# Altium project Project_Ontwerpen.PrjPcb
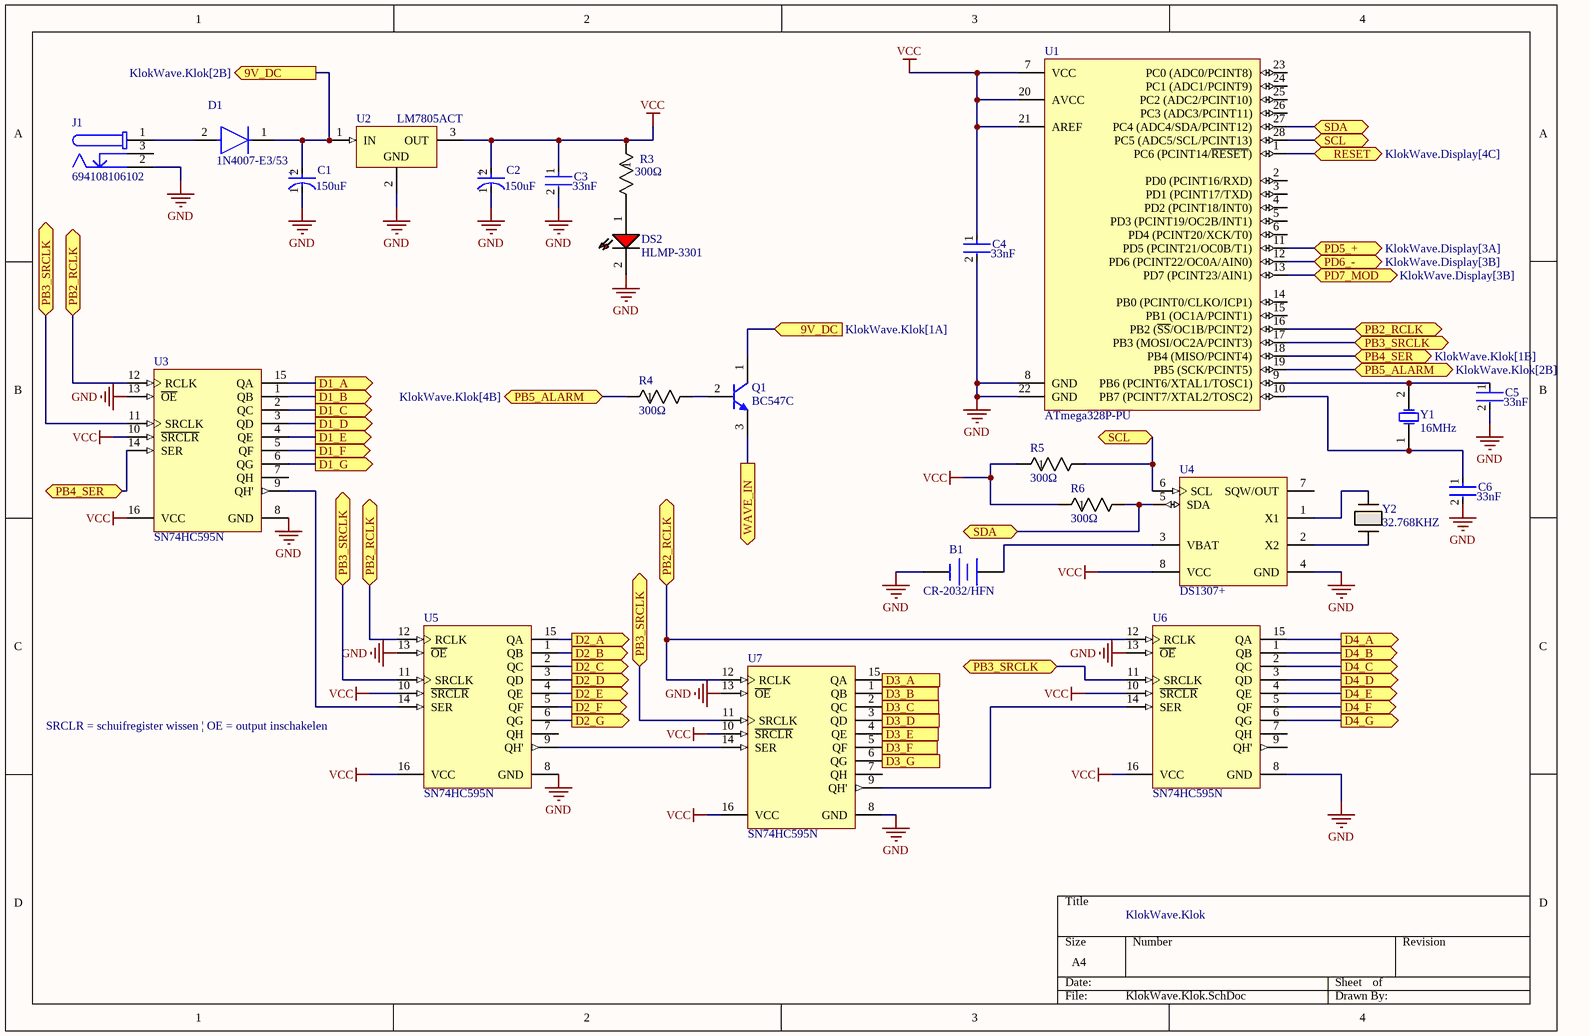
[diagram p0: KlokWave.Klok.SchDoc]
3 sheets, 111 parts. Net scope: flat (ports and power ports of the same name join across sheets).
Board file: KlokWave.PcbDoc
Sheets:
  KlokWave.Klok.SchDoc
  KlokWave.Wave.SchDoc
  KlokWave.Display.SchDoc

## Sheet KlokWave.Klok.SchDoc
size A4; SheetNumber: 1; SheetTotal: 3

### Parts
B1  CR-2032/HFN  [THT 3VBAT: PANA-CR-2032HFN]
C1  Capacitance: 150uF  [THT PolCondensator FP-OS-CON-TH-E7-d_0_45-MFG]  (hidden comment: 16SEPC150MD)
C2  Capacitance: 150uF  [THT PolCondensator FP-OS-CON-TH-E7-d_0_45-MFG]  (hidden comment: 16SEPC150MD)
C3  Capacitance: 33nF  [THT NonPol CerCOndensator: FP-565R30GASS33-MFG]  (hidden comment: 565R30GASS33)
C4  Capacitance: 33nF  [THT NonPol CerCOndensator: FP-565R30GASS33-MFG]  (hidden comment: 565R30GASS33)
C5  Capacitance: 33nF  [THT NonPol CerCOndensator: FP-565R30GASS33-MFG]  (hidden comment: 565R30GASS33)
C6  Capacitance: 33nF  [THT NonPol CerCOndensator: FP-565R30GASS33-MFG]  (hidden comment: 565R30GASS33)
D1  1N4007-E3/53  [THT Diode FP-1N4007-E3-53-MFG]
DS2  HLMP-3301  [THT LED: AVAG-HLMP-3301-2]
J1  694108106102  [THT DC Power Jack: 694106301002]
Q1  BC547C  [THT NPN Transistor: ONSC-TO-92-3-29-11_AM_BL]
R3  Resistance: 300Ω  [THT Resistor: RES_AC03_VIS]  (hidden comment: AC03000003000JAC00)
R4  Resistance: 300Ω  [THT Resistor: RES_AC03_VIS]  (hidden comment: AC03000003000JAC00)
R5  Resistance: 300Ω  [THT Resistor: RES_AC03_VIS]  (hidden comment: AC03000003000JAC00)
R6  Resistance: 300Ω  [THT Resistor: RES_AC03_VIS]  (hidden comment: AC03000003000JAC00)
U1  ATmega328P-PU  [THT ATMEGA328P-PU: 28P3]
U2  LM7805ACT  [THT LM7805: FAIR-TO-220-3]
U3  SN74HC595N  [THT 74HC595N: N0016A]
U4  DS1307+  [THT Chip DS1307: P8+2]
U5  SN74HC595N  [THT 74HC595N: N0016A]
U6  SN74HC595N  [THT 74HC595N: N0016A]
U7  SN74HC595N  [THT 74HC595N: N0016A]
Y1  16MHz  [THT 16 MHz: WE-XTAL_HC49/4H]
Y2  32.768KHZ  [THT 32 KHz OSC: XTAL_AB38T_ABR]

### Ports
9V_DC (in, see KlokWave.Klok[1A]), 9V_DC (out, see KlokWave.Klok[2B]), D1_A (out, see KlokWave.Display[2A]), D1_B (out, see KlokWave.Display[2A]), D1_C (out, see KlokWave.Display[2A]), D1_D (out, see KlokWave.Display[2A]), D1_E (out, see KlokWave.Display[2A]), D1_F (out, see KlokWave.Display[2A]), D1_G (out, see KlokWave.Display[2A]), D2_A (out, see KlokWave.Display[2B]), D2_B (out, see KlokWave.Display[2B]), D2_C (out, see KlokWave.Display[2B]), D2_D (out, see KlokWave.Display[2B]), D2_E (out, see KlokWave.Display[2B]), D2_F (out, see KlokWave.Display[2B]), D2_G (out, see KlokWave.Display[2B]), D3_A (out, see KlokWave.Display[2C]), D3_B (out, see KlokWave.Display[2C]), D3_C (out, see KlokWave.Display[2C]), D3_D (out, see KlokWave.Display[2C]), D3_E (out, see KlokWave.Display[2C]), D3_F (out, see KlokWave.Display[2C]), D3_G (out, see KlokWave.Display[2C]), D4_A (out, see KlokWave.Display[2C]), D4_B (out, see KlokWave.Display[2C]), D4_C (out, see KlokWave.Display[2C]), D4_D (out, see KlokWave.Display[2D]), D4_E (out, see KlokWave.Display[2D]), D4_F (out, see KlokWave.Display[2D]), D4_G (out, see KlokWave.Display[2D]), PB2_RCLK (bidir, see KlokWave.Klok[1B], KlokWave.Klok[1C], KlokWave.Klok[2C]), PB2_RCLK (bidir, see KlokWave.Klok[1B], KlokWave.Klok[1C], KlokWave.Klok[4B]), PB2_RCLK (bidir, see KlokWave.Klok[1B], KlokWave.Klok[2C], KlokWave.Klok[4B]), PB2_RCLK (bidir, see KlokWave.Klok[1C], KlokWave.Klok[2C], KlokWave.Klok[4B]), PB3_SRCLK (bidir, see KlokWave.Klok[1B], KlokWave.Klok[1C], KlokWave.Klok[2C], KlokWave.Klok[3C]), PB3_SRCLK (bidir, see KlokWave.Klok[1B], KlokWave.Klok[1C], KlokWave.Klok[2C], KlokWave.Klok[4B]), PB3_SRCLK (bidir, see KlokWave.Klok[1B], KlokWave.Klok[1C], KlokWave.Klok[3C], KlokWave.Klok[4B]), PB3_SRCLK (bidir, see KlokWave.Klok[1B], KlokWave.Klok[2C], KlokWave.Klok[3C], KlokWave.Klok[4B]), PB3_SRCLK (bidir, see KlokWave.Klok[1C], KlokWave.Klok[2C], KlokWave.Klok[3C], KlokWave.Klok[4B]), PB4_SER (bidir, see KlokWave.Klok[1B]), PB4_SER (bidir, see KlokWave.Klok[4B]), PB5_ALARM (bidir, see KlokWave.Klok[2B]), PB5_ALARM (bidir, see KlokWave.Klok[4B]), PD5_+ (bidir, see KlokWave.Display[3A]), PD6_- (bidir, see KlokWave.Display[3B]), PD7_MOD (bidir, see KlokWave.Display[3B]), RESET (bidir, see KlokWave.Display[4C]), SCL (bidir, see KlokWave.Klok[3B]), SCL (bidir, see KlokWave.Klok[4A]), SDA (bidir, see KlokWave.Klok[3C]), SDA (bidir, see KlokWave.Klok[4A]), WAVE_IN (out, see KlokWave.Wave[4A])

### Nets
GND: B1.2(-) C1.1(C) C2.1(C) C3.2 C4.2 C5.2 C6.2 DS2.2(A) J1.2 U1.8(GND) U1.22(GND) U2.2(GND) U3.8(GND) U3.13(~{OE}) U4.4(GND) U5.8(GND) U5.13(~{OE}) U6.8(GND) U6.13(~{OE}) U7.8(GND) U7.13(~{OE})
VCC: C2.2(A) C3.1 C4.1 R3.1 R5.1 R6.1 U1.7(VCC) U1.20(AVCC) U1.21(AREF) U2.3(OUT) U3.10(~{SRCLR}) U3.16(VCC) U4.8(VCC) U5.10(~{SRCLR}) U5.16(VCC) U6.10(~{SRCLR}) U6.16(VCC) U7.10(~{SRCLR}) U7.16(VCC)
NetB1_1: B1.1(+) U4.3(VBAT)
NetC1_2: C1.2(A) D1.1(C) Q1.1(C) U2.1(IN) ; port 9V_DC
NetC5_1: C5.1 U1.9(PB6_(PCINT6/XTAL1/TOSC1)) Y1.2(OSC2)
NetC6_1: C6.1 U1.10(PB7_(PCINT7/XTAL2/TOSC2)) Y1.1(OSC1)
NetC19_2: Q1.3(E) ; port WAVE_IN
NetD1_2: D1.2(A) J1.1
NetDS2_1: DS2.1(K) R3.2
NetLED1_1: U3.4(QE) ; port D1_E
NetLED1_2: U3.3(QD) ; port D1_D
NetLED1_4: U3.2(QC) ; port D1_C
NetLED1_6: U3.1(QB) ; port D1_B
NetLED1_7: U3.15(QA) ; port D1_A
NetLED1_9: U3.5(QF) ; port D1_F
NetLED1_10: U3.6(QG) ; port D1_G
NetLED2_1: U5.4(QE) ; port D2_E
NetLED2_2: U5.3(QD) ; port D2_D
NetLED2_4: U5.2(QC) ; port D2_C
NetLED2_6: U5.1(QB) ; port D2_B
NetLED2_7: U5.15(QA) ; port D2_A
NetLED2_9: U5.5(QF) ; port D2_F
NetLED2_10: U5.6(QG) ; port D2_G
NetLED3_1: U7.4(QE) ; port D3_E
NetLED3_2: U7.3(QD) ; port D3_D
NetLED3_4: U7.2(QC) ; port D3_C
NetLED3_6: U7.1(QB) ; port D3_B
NetLED3_7: U7.15(QA) ; port D3_A
NetLED3_9: U7.5(QF) ; port D3_F
NetLED3_10: U7.6(QG) ; port D3_G
NetLED4_1: U6.4(QE) ; port D4_E
NetLED4_2: U6.3(QD) ; port D4_D
NetLED4_4: U6.2(QC) ; port D4_C
NetLED4_6: U6.1(QB) ; port D4_B
NetLED4_7: U6.15(QA) ; port D4_A
NetLED4_9: U6.5(QF) ; port D4_F
NetLED4_10: U6.6(QG) ; port D4_G
NetQ1_2: Q1.2(B) R4.2
NetR4_1: R4.1 U1.19(PB5_(SCK/PCINT5)) ; port PB5_ALARM
NetR5_2: R5.2 U1.28(PC5_(ADC5/SCL/PCINT13)) U4.6(SCL) ; port SCL
NetR6_2: R6.2 U1.27(PC4_(ADC4/SDA/PCINT12)) U4.5(SDA) ; port SDA
NetR50_1: U1.1(PC6_(PCINT14/~{RESET})) ; port RESET
NetSW1_1: U1.11(PD5_(PCINT21/OC0B/T1)) ; port PD5_+
NetSW2_1: U1.12(PD6_(PCINT22/OC0A/AIN0)) ; port PD6_-
NetSW3_1: U1.13(PD7_(PCINT23/AIN1)) ; port PD7_MOD
NetU1_16: U1.16(PB2_(~{SS}/OC1B/PCINT2)) U3.12(RCLK) U5.12(RCLK) U6.12(RCLK) U7.12(RCLK) ; port PB2_RCLK
NetU1_17: U1.17(PB3_(MOSI/OC2A/PCINT3)) U3.11(SRCLK) U5.11(SRCLK) U6.11(SRCLK) U7.11(SRCLK) ; port PB3_SRCLK
NetU1_18: U1.18(PB4_(MISO/PCINT4)) U3.14(SER) ; port PB4_SER
NetU3_9: U3.9(QH') U5.14(SER)
NetU4_1: U4.1(X1) Y2.1
NetU4_2: U4.2(X2) Y2.2
NetU5_9: U5.9(QH') U7.14(SER)
NetU6_14: U6.14(SER) U7.9(QH')

Not connected (* = marked no-connect by the designer): J1 3; U1 2(PD0_(PCINT16/RXD)) 3(PD1_(PCINT17/TXD)) 4(PD2_(PCINT18/INT0)) 5(PD3_(PCINT19/OC2B/INT1)) 6(PD4_(PCINT20/XCK/T0)) 14(PB0_(PCINT0/CLKO/ICP1)) 15(PB1_(OC1A/PCINT1)) 23(PC0_(ADC0/PCINT8)) 24(PC1_(ADC1/PCINT9)) 25(PC2_(ADC2/PCINT10)) 26(PC3_(ADC3/PCINT11)); U3 7(QH); U4 7(SQW/OUT); U5 7(QH); U6 7(QH) 9(QH'); U7 7(QH)

### Notes on the sheet
- (near U5) SRCLR = schuifregister wissen | OE = output inschakelen
- KlokWave.Klok
- (in symbol CMP-05428-000489-1) +

### Library data of the parts
B1 = CMP-2000-05296-1: Coin Cell Battery, 225 mAh, 0.2 mA, 3 V, -30 to 60 degC, Bulk; Manufacturer: Panasonic; SVHC: 1,2-dimethoxyethane,ethyleneglycoldimethylether(EGDME)(15-Jun-2015); Battery Size Code: 2032; Battery Voltage: 3V; Battery IEC Code: CR2032; Battery NEDA Code: 5004LC; External Height: 3.2mm; Battery Terminals: PCBPins; Battery Capacity: 220mAh; External Diameter: 20mm; Battery Technology: LithiumManganeseDioxide; Product Range: -; Datasheet Version: Rev. 0, 05/2010; Manufacturer URL: http://www.panasonic.com/; External Depth: -; Weight: 2.9g; Datasheet URL: https://datasheet.ciiva.com/3/aaa4000de87-3072.pdf; External Width: -
C1 C2 = CMP-05428-000489-1: Conductive Polymer Aluminum Solid Capacitors (OS-CON) 150uF ±20% 16V RADIAL TH 8x7mm; Ripple Current: 3.22A; ESR (Equivalent Series Resistance): 22mR; Polarity: Polar; Leakage Current: 500uA; Dissipation Factor: 12%; Life (Hours): 5000Hour; Lead Diameter: 0.45mm; Voltage Rating: 16V; Case/Package: Radial; Mount: Through Hole; Series: OS-CON™, SEPC; Lead Pitch: 3.5mm; Height - Seated (Max): 0.276inch; Diameter: 8mm; Max Operating Temperature: 105°C; Length: 7mm; Voltage Rating (DC): 16V; Lead Free: Lead Free; RoHS Compliant: Yes; Package Quantity: 200; Voltage: 16V; Packaging: Bulk; Tolerance: 20%; REACH SVHC: No SVHC; Termination: Radial; Number of Pins: 7; Min Operating Temperature: -55°C; Height: 7mm
C3-C6 = CMP-00030-41968055-1: 565R30GASS33 33nF 3 kV dc THT Ceramic Single Layer Capacitor; Z5U Dielectric Radial 565R Series; Voltage: 3kV; Tolerance: 20%; Lead Diameter: 640µm; Diameter: 22.9mm; Lead Free: Lead Free; Material: Ceramic; Schedule B: 8532230060; Depth: 6.1mm; Mount: Radial; Max Operating Temperature: 105°C; Composition: Ceramic; RoHS: Compliant; Min Operating Temperature: -25°C; Dielectric: Z5U; NexarPartId: 41968055; Height: 22.9mm; Voltage Rating: 3kV; Lead Pitch: 9.52mm; Termination: Radial; Packaging: Bulk; Case/Package: Radial; Voltage Rating (DC): 3kV
D1 = CMP-02540-000066-1: 1N4007 DIODE GEN PURP 1KV 1A DO204AL; Max Surge Current: 45A; Max Reverse Current: 5uA; Element Configuration: Single; Max Repetitive Reverse Voltage (Vrrm): 1kV; Max Reverse Voltage (DC): 1kV; Packaging: Tape and Reel; Peak Non-Repetitive Surge Current: 45A; Reverse Voltage: 1kV; Number of Pins: 2; Contact Plating: Tin; Mount: Through Hole; Package Quantity: 3000; Case/Package: DO-41; Radiation Hardening: No; Max Operating Temperature: 150°C; Series: -; Min Operating Temperature: -50°C; Average Rectified Current: 1A
DS2 = CMP-2000-06411-1: T-1 3/4 (5 mm) Diffused LED Lamp, 1.9 V, -40 to 100 degC, 2-Pin THD; Manufacturer: Avago; Forward Current: 25mA; Forward Voltage: 2.4V; Peak Wavelength: 635nm; Shape Type: Circular; High Brightness: No; Main Category: StandardLED; Test Current (It): 10mA; Dominant Wave Length: 626nm; Number of  Elements: 1; Reverse Voltage: 5V; Chip Material: GaP; Product Height (mm): 9.19mm; Lens Type: ColoredDiffused; Viewing Angle: 60deg; Type: Uni-Color; Emitting Color: Red; Luminous Intensity: 5.4mcd; Power Dissipation: 85W; DELETED: Compliant; Product Depth (mm): 6.1mm; Package Description: 2-Pin Through Hole LED, Dia 5.85 mm; Mounting Technology: ThroughHole; Manufacturer URL: http://www.avagotech.com/; Package Type: T-13/4; Operating Temp Range: -40Cto100C; Datasheet URL: http://www.avagotech.com/docs/AV02-1558EN; Mounting: ThroughHole; Lens Dimensions: 5.08x5.08x8.3mm; Package Reference: HLMP-3301; Datasheet Version: 03/2015; Pin Count: 2; Packaging: TapeandReel; Operating Temperature Classification: Industrial; Lum Intensity: 5.4mcd; Rad Hardened: No; Product Length (mm): 6.1mm
J1 = CMP-1502-00180-2: DC Power JAck; NexarPartId: 52645186; Shielding: Unshielded; Voltage Rating: 24V; Insulation Resistance: 100MΩ; Current Rating: 5A; Gender: Male; RoHS: Compliant; Housing Material: Polyamide; Connector Type: Power; Flammability Rating: UL94 V-0; Contact Gender: Female; Mount: Surface Mount; Termination: SMD/SMT; Contact Plating: Tin; Max Operating Temperature: 85°C; Operating Supply Voltage: 24V; Voltage Rating (DC): 24V; REACH SVHC: Unknown; Packaging: Tape and Reel; Min Operating Temperature: -40°C; Color: Black
Q1 = CMP-1048-01437-1: BC547C: THT Amplifier Transistor, NPN Silicon, 3-Pin TO-92, Bulk Box; Manufacturer: On Semiconductor; IC Continuous (A): 0.1; fT Min (MHz): 150; Mounting Technology: Through Hole; ComponentLink1URL: http://www.onsemi.com/; ComponentLink1Description: Manufacturer URL; ComponentLink3URL: http://www.onsemi.cn/pub_link/Collateral/2N6426-D.PDF; DatasheetVersion: Rev. 7; PackageVersion: Rev. AM; Packing: Bulk Box; RoHS: FALSE; Polarity: NPN; PartNumber: BC547C; ComponentLink2URL: http://www.onsemi.com/pub_link/Collateral/BC546-D.PDF; ComponentLink3Description: Package Specification; PackageDescription: 3-Pin Transistor Outline, Body 4.825 x 3.685 mm, Pitch 1.27 mm; PackageReference: TO-92-3-29-11_AM_SL; ComponentLink2Description: Datasheet
R3-R6 = CMP-00030-39746760-1: AC03000003000JAC00 Res Wirewound THT; Voltage Rating (DC): 30V; Lead Diameter: 800µm; Max Power Dissipation: 3W; Tolerance: 5%; Temperature Coefficient: -80ppm/°C; Max Operating Temperature: 275°C; Number of Pins: 2; Termination: Axial; Diameter: 4.8mm; Contact Plating: Tin; Packaging: Cut Tape (CT); Schedule B: 8533210080, 8533210080|8533210080|8533210080|8533210080|8533210080; Voltage Rating: 30V; Military Standard: Not; Composition: Wirewound; Power Rating: 3W; NexarPartId: 39746760; Case/Package: Axial; REACH SVHC: Unknown; Min Operating Temperature: -40°C; Thickness: 4.8006mm; Features: Flame Retardant Coating; Width: 4.8mm; Length: 13mm; RoHS: Compliant; Number of Terminations: 2
U1 = CMP-0095-00013-2: 8-bit AVR Microcontroller, 32KB Flash, 1KB EEPROM, 2KB SRAM, 28-pin PDIP, Industrial Grade (-40°C to 85°C); RevisionNote: DatasheetVersion updated. URLs added.; PackageVersion: revB, Sep-2001; PackageDescription: 28-lead (0.300"/7.62mm Wide) Plastic Dual Inline Package (PDIP); DatasheetVersion: revD, May-2011; ComponentLink1Description: Manufacturer URL; ComponentLink1URL: http://www.atmel.com/; PackageReference: 28P3; ComponentLink2Description: ATmega48A/48PA/88A/88PA/168A/168PA/328/328P Datasheet; ComponentLink3URL: http://www.atmel.com/dyn/resources/prod_documents/8271S.pdf; ComponentLink2URL: http://www.atmel.com/dyn/resources/prod_documents/8271.pdf; ComponentLink3Description: ATmega48A/48PA/88A/88PA/168A/168PA/328/328P Summary
U2 = CMP-2000-04937-1: Positive Voltage Regulator, 5 V, 1 A, 0 to 125 degC, 3-Pin TO-220, RoHS, Tube; Manufacturer: Fairchild; Number of Outputs: 1; Typical Dropout Voltage @ Current: 2V@1A; Output Type: Fixed; Output Voltage: 5V; Quiescent Current: 6mA; Dropout Voltage Measurement Current: 1A; Line Regulation: 50mV; Maximum Input Voltage: 35V; Regulator Function: Linear; Load Regulation: 100mV; Package Type: TO-220; Mounting Type: ThroughHole; Height: 16.51mm; Maximum Operating Temperature: +125degC; Datasheet Version: Rev. 1.0.1, 05/2006; Package Reference: TO-220; Minimum Operating Temperature: 0degC; Manufacturer URL: https://www.fairchildsemi.com/; Package URL: https://www.fairchildsemi.com/package-drawings/TO/TO220B03.pdf; Length: 10.67mm; Series: LM78xx; Dimensions: 10.67x4.83x16.51mm; Polarity: Positive; Maximum Output Current: 1A; Pin Count: 3; Width: 4.83mm; Package Description: 3-Pin Through Hole Device, Body 10 x 4.5 mm, Pitch 2.54 mm; Datasheet URL: https://datasheet.ciiva.com/5816/1359194-5816420.pdf
U3 U5-U7 = CMP-0780-00137-3: 8-Bit Shift Registers With 3-State Output Registers, N0016A, TUBE; Manufacturer: Texas Instruments; F @ Nom Voltage(Max)(Mhz): 28; Input Type: CMOS; Bits: 8; VCC(Min)(V): 2; 3-State Output: Yes; ICC @ Nom Voltage(Max)(mA): 0.08; VCC(Max)(V): 6; tpd @ Nom Voltage(Max)(ns): 34; Rating: Military; Technology Family: HC; Output Drive (IOL/IOH)(Max)(mA): 7.8/-7.8; Code_JEDEC: MS-001; Output Type: CMOS; Operating Temperature Range(C): -40 to 85; Voltage(Nom)(V): 6; Generic Part Number: SN74HC595; DatasheetVersion: SCLS041H; PackageReference: N0016A; PackageVersion: http://www.ti.com/lit/ml/mpdi002c/mpdi002c.pdf
U4 = CMP-0254-00152-1: 64 x 8, Serial, I2C Real-Time Clock, 5.0V, 8-Pin PDIP, 0 to 70 degC, Pb-Free; ComponentLink2URL: http://datasheets.maxim-ic.com/en/ds/DS1307.pdf; ComponentLink3URL: http://pdfserv.maxim-ic.com/package_dwgs/21-0043.PDF; ComponentLink1Description: Manufacturer URL; PackageVersion: revE, 2011; ComponentLink1URL: http://www.maxim-ic.com; PackageDescription: 8-Pin Plastic Dual-In-Line, Narrow (0.3in), Pitch 2.54 mm, PDIP(N), Pb-Free; ComponentLink2Description: Datasheet; Code_JEDEC: MS-001-AB; PackageReference: P8+2; DatasheetVersion: 10-Feb-2008; ComponentLink3Description: Package Specification
Y1 = 830003240B: THT Quartz Crystal, HC49/4H, 16MHz, +/-30ppm WE-XTAL; Manufacturer: Wurth Elektronik; Frequency Stability: +/-50ppm; Load Capacitance: 30pF; ComponentLink1Description: Website Link; ComponentLink1URL: https://www.we-online.com/redexpert/article/830003240B?ad; ComponentLink2Description: Datasheet Link; ComponentLink2URL: https://www.we-online.com/redexpert/spec/830003240B?ad; Manufacturer Part Number: 830003240B; Category: Crystals; Match Code: WE-XTAL; Mount: Through Hole; Operating Temperature Max: 70°C; Operating Temperature Min: -20°C; Packaging: Bulk; Case/Size Code: HC49/4H; Length: 11.05mm; Width: 4.7mm; Height: 4.1mm; Frequency: 16MHz; Frequency Tolerance: +/-30ppm
Y2 = AB38T-32.768KHZ: THT CRYSTAL 32.7680KHZ 12.5PF TH; Mfr_Name: Abracon

## Sheet KlokWave.Wave.SchDoc
size A4; SheetNumber: 2; SheetTotal: 3
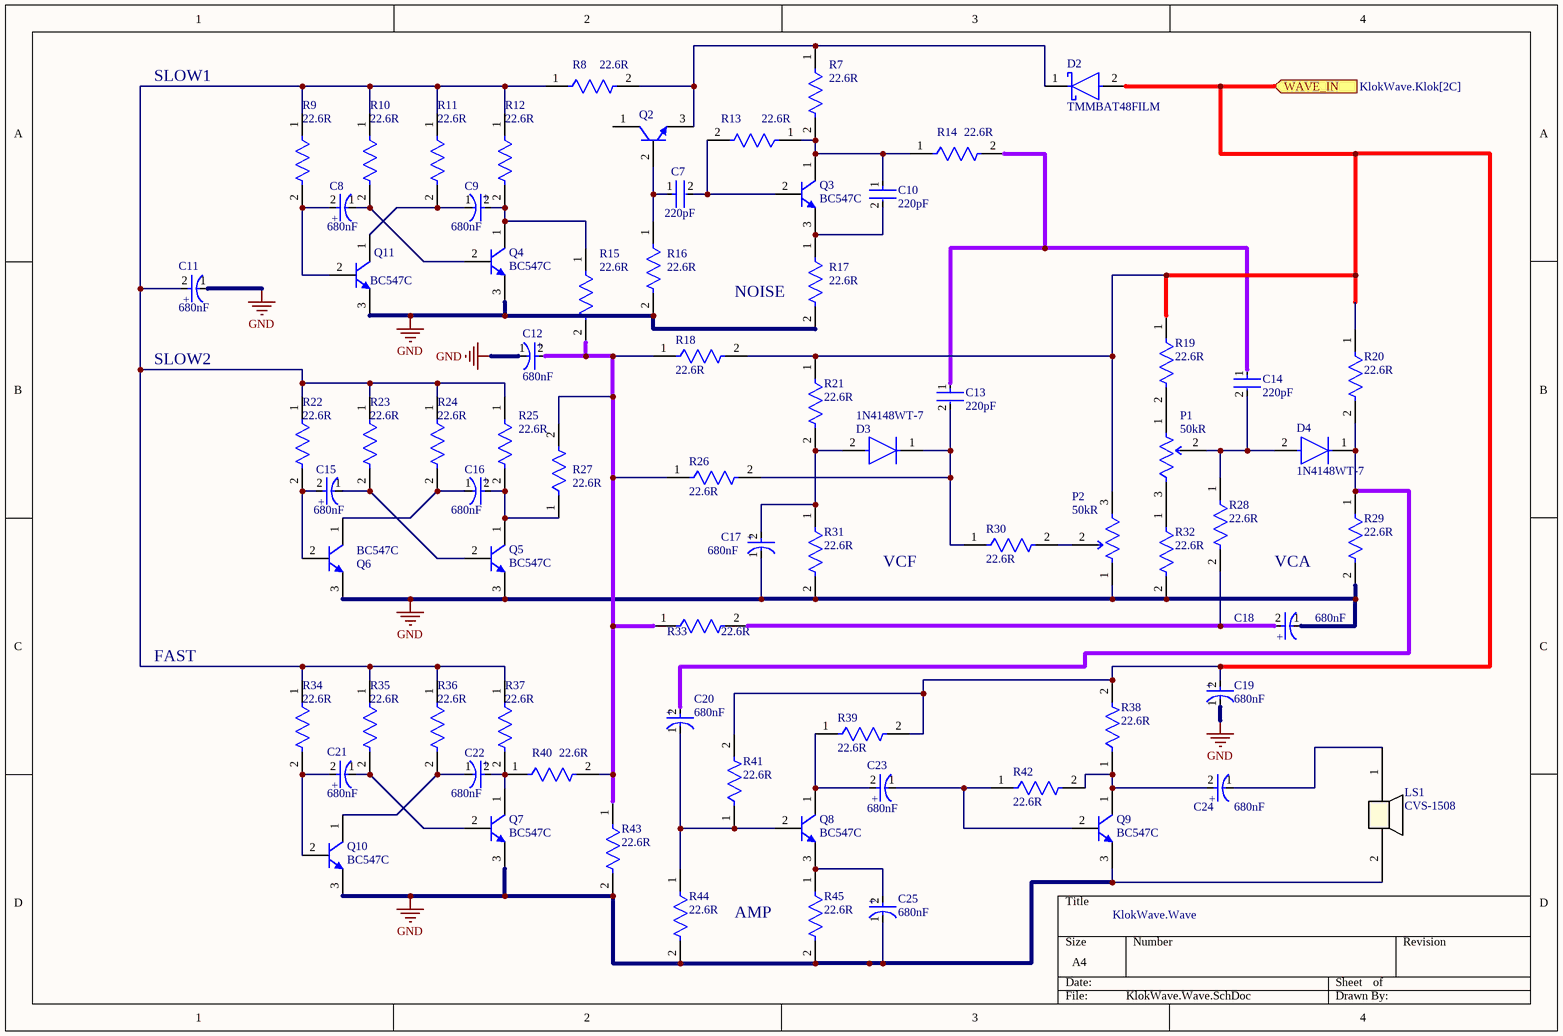
[diagram p1: KlokWave.Wave.SchDoc]

### Parts
C7  Capacitance: 220pF  [SMD RES: 0805ph]  (hidden comment: CL21C221FBANNNC)
C8  Capacitance: 680nF  [SMD Elco pol: FP-OS-CON-SMT-C6-MFG]  (hidden comment: FP-OS-CON-SMT-C6-MFG)
C9  Capacitance: 680nF  [SMD Elco pol: FP-OS-CON-SMT-C6-MFG]  (hidden comment: FP-OS-CON-SMT-C6-MFG)
C10  Capacitance: 220pF  [SMD RES: 0805ph]  (hidden comment: CL21C221FBANNNC)
C11  Capacitance: 680nF  [SMD Elco pol: FP-OS-CON-SMT-C6-MFG]  (hidden comment: FP-OS-CON-SMT-C6-MFG)
C12  Capacitance: 680nF  [SMD Elco pol: FP-OS-CON-SMT-C6-MFG]  (hidden comment: FP-OS-CON-SMT-C6-MFG)
C13  Capacitance: 220pF  [SMD RES: 0805ph]  (hidden comment: CL21C221FBANNNC)
C14  Capacitance: 220pF  [SMD RES: 0805ph]  (hidden comment: CL21C221FBANNNC)
C15  Capacitance: 680nF  [SMD Elco pol: FP-OS-CON-SMT-C6-MFG]  (hidden comment: FP-OS-CON-SMT-C6-MFG)
C16  Capacitance: 680nF  [SMD Elco pol: FP-OS-CON-SMT-C6-MFG]  (hidden comment: FP-OS-CON-SMT-C6-MFG)
C17  Capacitance: 680nF  [SMD Elco pol: FP-OS-CON-SMT-C6-MFG]  (hidden comment: FP-OS-CON-SMT-C6-MFG)
C18  Capacitance: 680nF  [SMD Elco pol: FP-OS-CON-SMT-C6-MFG]  (hidden comment: FP-OS-CON-SMT-C6-MFG)
C19  Capacitance: 680nF  [SMD Elco pol: FP-OS-CON-SMT-C6-MFG]  (hidden comment: FP-OS-CON-SMT-C6-MFG)
C20  Capacitance: 680nF  [SMD Elco pol: FP-OS-CON-SMT-C6-MFG]  (hidden comment: FP-OS-CON-SMT-C6-MFG)
C21  Capacitance: 680nF  [SMD Elco pol: FP-OS-CON-SMT-C6-MFG]  (hidden comment: FP-OS-CON-SMT-C6-MFG)
C22  Capacitance: 680nF  [SMD Elco pol: FP-OS-CON-SMT-C6-MFG]  (hidden comment: FP-OS-CON-SMT-C6-MFG)
C23  Capacitance: 680nF  [SMD Elco pol: FP-OS-CON-SMT-C6-MFG]  (hidden comment: FP-OS-CON-SMT-C6-MFG)
C24  Capacitance: 680nF  [SMD Elco pol: FP-OS-CON-SMT-C6-MFG]  (hidden comment: FP-OS-CON-SMT-C6-MFG)
C25  Capacitance: 680nF  [SMD Elco pol: FP-OS-CON-SMT-C6-MFG]  (hidden comment: FP-OS-CON-SMT-C6-MFG)
D2  TMMBAT48FILM  [SMD Diode BAT48 FP-MINIMELF-MFG]
D3  1N4148WT-7  [SMD Diode Rect: FP-SOD523-MFG]
D4  1N4148WT-7  [SMD Diode Rect: FP-SOD523-MFG]
LS1  CVS-1508  [THT speaker: CVS-1508_CUD]
P1  Resistance: 50kR  [SMD POT: FP-3361P-MFG]  (hidden comment: 3361P-1-503GLF)
P2  Resistance: 50kR  [SMD POT: FP-3361P-MFG]  (hidden comment: 3361P-1-503GLF)
Q2  BC547C  [THT NPN Transistor: ONSC-TO-92-3-29-11_AM_BL]  (value not drawn)
Q3  BC547C  [THT NPN Transistor: ONSC-TO-92-3-29-11_AM_BL]
Q4  BC547C  [THT NPN Transistor: ONSC-TO-92-3-29-11_AM_BL]
Q5  BC547C  [THT NPN Transistor: ONSC-TO-92-3-29-11_AM_BL]
Q6  BC547C  [THT NPN Transistor: ONSC-TO-92-3-29-11_AM_BL]
Q7  BC547C  [THT NPN Transistor: ONSC-TO-92-3-29-11_AM_BL]
Q8  BC547C  [THT NPN Transistor: ONSC-TO-92-3-29-11_AM_BL]
Q9  BC547C  [THT NPN Transistor: ONSC-TO-92-3-29-11_AM_BL]
Q10  BC547C  [THT NPN Transistor: ONSC-TO-92-3-29-11_AM_BL]
Q11  BC547C  [THT NPN Transistor: ONSC-TO-92-3-29-11_AM_BL]
R7  Resistance: 22.6R  [SMD RES: 0805ph]  (hidden comment: CR0805-FX-22R6ELF)
R8  Resistance: 22.6R  [SMD RES: 0805ph]  (hidden comment: CR0805-FX-22R6ELF)
R9  Resistance: 22.6R  [SMD RES: 0805ph]  (hidden comment: CR0805-FX-22R6ELF)
R10  Resistance: 22.6R  [SMD RES: 0805ph]  (hidden comment: CR0805-FX-22R6ELF)
R11  Resistance: 22.6R  [SMD RES: 0805ph]  (hidden comment: CR0805-FX-22R6ELF)
R12  Resistance: 22.6R  [SMD RES: 0805ph]  (hidden comment: CR0805-FX-22R6ELF)
R13  Resistance: 22.6R  [SMD RES: 0805ph]  (hidden comment: CR0805-FX-22R6ELF)
R14  Resistance: 22.6R  [SMD RES: 0805ph]  (hidden comment: CR0805-FX-22R6ELF)
R15  Resistance: 22.6R  [SMD RES: 0805ph]  (hidden comment: CR0805-FX-22R6ELF)
R16  Resistance: 22.6R  [SMD RES: 0805ph]  (hidden comment: CR0805-FX-22R6ELF)
R17  Resistance: 22.6R  [SMD RES: 0805ph]  (hidden comment: CR0805-FX-22R6ELF)
R18  Resistance: 22.6R  [SMD RES: 0805ph]  (hidden comment: CR0805-FX-22R6ELF)
R19  Resistance: 22.6R  [SMD RES: 0805ph]  (hidden comment: CR0805-FX-22R6ELF)
R20  Resistance: 22.6R  [SMD RES: 0805ph]  (hidden comment: CR0805-FX-22R6ELF)
R21  Resistance: 22.6R  [SMD RES: 0805ph]  (hidden comment: CR0805-FX-22R6ELF)
R22  Resistance: 22.6R  [SMD RES: 0805ph]  (hidden comment: CR0805-FX-22R6ELF)
R23  Resistance: 22.6R  [SMD RES: 0805ph]  (hidden comment: CR0805-FX-22R6ELF)
R24  Resistance: 22.6R  [SMD RES: 0805ph]  (hidden comment: CR0805-FX-22R6ELF)
R25  Resistance: 22.6R  [SMD RES: 0805ph]  (hidden comment: CR0805-FX-22R6ELF)
R26  Resistance: 22.6R  [SMD RES: 0805ph]  (hidden comment: CR0805-FX-22R6ELF)
R27  Resistance: 22.6R  [SMD RES: 0805ph]  (hidden comment: CR0805-FX-22R6ELF)
R28  Resistance: 22.6R  [SMD RES: 0805ph]  (hidden comment: CR0805-FX-22R6ELF)
R29  Resistance: 22.6R  [SMD RES: 0805ph]  (hidden comment: CR0805-FX-22R6ELF)
R30  Resistance: 22.6R  [SMD RES: 0805ph]  (hidden comment: CR0805-FX-22R6ELF)
R31  Resistance: 22.6R  [SMD RES: 0805ph]  (hidden comment: CR0805-FX-22R6ELF)
R32  Resistance: 22.6R  [SMD RES: 0805ph]  (hidden comment: CR0805-FX-22R6ELF)
R33  Resistance: 22.6R  [SMD RES: 0805ph]  (hidden comment: CR0805-FX-22R6ELF)
R34  Resistance: 22.6R  [SMD RES: 0805ph]  (hidden comment: CR0805-FX-22R6ELF)
R35  Resistance: 22.6R  [SMD RES: 0805ph]  (hidden comment: CR0805-FX-22R6ELF)
R36  Resistance: 22.6R  [SMD RES: 0805ph]  (hidden comment: CR0805-FX-22R6ELF)
R37  Resistance: 22.6R  [SMD RES: 0805ph]  (hidden comment: CR0805-FX-22R6ELF)
R38  Resistance: 22.6R  [SMD RES: 0805ph]  (hidden comment: CR0805-FX-22R6ELF)
R39  Resistance: 22.6R  [SMD RES: 0805ph]  (hidden comment: CR0805-FX-22R6ELF)
R40  Resistance: 22.6R  [SMD RES: 0805ph]  (hidden comment: CR0805-FX-22R6ELF)
R41  Resistance: 22.6R  [SMD RES: 0805ph]  (hidden comment: CR0805-FX-22R6ELF)
R42  Resistance: 22.6R  [SMD RES: 0805ph]  (hidden comment: CR0805-FX-22R6ELF)
R43  Resistance: 22.6R  [SMD RES: 0805ph]  (hidden comment: CR0805-FX-22R6ELF)
R44  Resistance: 22.6R  [SMD RES: 0805ph]  (hidden comment: CR0805-FX-22R6ELF)
R45  Resistance: 22.6R  [SMD RES: 0805ph]  (hidden comment: CR0805-FX-22R6ELF)

### Ports
WAVE_IN (in, see KlokWave.Klok[2C])

### Nets
GND: C11.1(C) C12.1(C) C17.1(C) C18.1(C) C19.1(C) C25.1(C) LS1.2 P2.1(CCW) Q4.3(E) Q5.3(E) Q6.3(E) Q7.3(E) Q9.3(E) Q10.3(E) Q11.3(E) R16.2 R17.2 R29.2 R31.2 R32.2 R43.2 R44.2 R45.2
NetC7_1: C7.1 Q2.2(B) R16.1
NetC7_2: C7.2 Q3.2(B) R13.2
NetC8_1: C8.1(C) Q4.2(B) R10.2
NetC8_2: C8.2(A) Q11.2(B) R9.2
NetC9_1: C9.1(C) Q11.1(C) R11.2
NetC9_2: C9.2(A) Q4.1(C) R12.2 R15.1
NetC10_1: C10.1 Q3.1(C) R7.2 R13.1 R14.1
NetC10_2: C10.2 Q3.3(E) R17.1
NetC11_2: C11.2(A) R8.1 R9.1 R10.1 R11.1 R12.1 R22.1 R23.1 R24.1 R25.1 R34.1 R35.1 R36.1 R37.1
NetC12_2: C12.2(A) R15.2 R18.1 R26.1 R27.2 R33.1 R40.2 R43.1
NetC13_1: C13.1 C14.1 R14.2
NetC13_2: C13.2 D3.1(C) R26.2 R30.1
NetC14_2: C14.2 D4.2(A) P1.2(WIPER) R28.1
NetC15_1: C15.1(C) Q5.2(B) R23.2
NetC15_2: C15.2(A) Q6.2(B) R22.2
NetC16_1: C16.1(C) Q6.1(C) R24.2
NetC16_2: C16.2(A) Q5.1(C) R25.2 R27.1
NetC17_2: C17.2(A) D3.2(A) R21.2 R31.1
NetC18_2: C18.2(A) R28.2 R33.2
NetC19_2: C19.2(A) D2.2(A) P2.3(CW) R18.2 R19.1 R20.1 R21.1 R38.2 R39.2 R41.2 ; port WAVE_IN
NetC20_1: C20.1(C) Q8.2(B) R41.1 R44.1
NetC20_2: C20.2(A) D4.1(C) R20.2 R29.1
NetC21_1: C21.1(C) Q7.2(B) R35.2
NetC21_2: C21.2(A) Q10.2(B) R34.2
NetC22_1: C22.1(C) Q10.1(C) R36.2
NetC22_2: C22.2(A) Q7.1(C) R37.2 R40.1
NetC23_1: C23.1(C) Q9.2(B) R42.1
NetC23_2: C23.2(A) Q8.1(C) R39.1
NetC24_1: C24.1(C) LS1.1
NetC24_2: C24.2(A) Q9.1(C) R38.1 R42.2
NetC25_2: C25.2(A) Q8.3(E) R45.1
NetD2_1: D2.1(C) Q2.3(E) R7.1 R8.2
NetP1_1: P1.1(CCW) R19.2
NetP1_3: P1.3(CW) R32.1
NetP2_2: P2.2(WIPER) R30.2

Not connected (* = marked no-connect by the designer): Q2 1(C)

### Notes on the sheet
- SLOW1
- NOISE
- SLOW2
- VCF
- VCA
- FAST
- AMP
- KlokWave.Wave
- (in symbol FP-OS-CON-SMT-C6-MFG) +

### Library data of the parts
C7 C10 C13 C14 = CMP-13271-000769-1: SMD cap nonpol: CL21 Series 0805 220pF 50V ±1% Tolerance C0G Multilayer Ceramic Chip Capacitor; Min Operating Temperature: -55°C; Radiation Hardening: No; Case/Package: 0805; Max Operating Temperature: 125°C; Height: 0.65mm; Depth: 1.25mm; Packaging: Tape and Reel; Thickness: 0.03inch; Voltage Rating: 50V; Case Code (Imperial): 0805; Lead Free: Lead Free; Width: 0.049inch; Tolerance: 1%; Mount: Surface Mount; Dielectric: C0G; Case Code (Metric): 2012; Material: Ceramic; Voltage Rating (DC): 50V; Package Quantity: 1; Length: 0.079inch
C8 C9 C11 C12 C15-C25 = FP-OS-CON-SMT-C6-MFG: SMD Elco Capacitor; Leakage Current: 500nA; Tolerance: 10%; Dissipation Factor: 4%; ESR (Equivalent Series Resistance): 25R; Voltage Rating: 16V; Dielectric Material: Tantalum; Mount: Surface Mount; Termination: SMD/SMT; Construction: Flat; Height: 1.2mm; Series: TAJ; Width: 1.3mm; Case Code (Imperial): 0805; Length: 2.05mm; Package Quantity: 2500; Min Operating Temperature: -55°C; Radiation Hardening: No; Lead Free: Lead Free; Case/Package: 0805; Height - Seated (Max): 0.047inch; Weight: 0.000194oz; Voltage Rating (DC): 16V; Features: General Purpose; Depth: 1.3mm; RoHS Compliant: Yes; Case Code (Metric): 2012; Packaging: Tape and Reel; Max Operating Temperature: 125°C; REACH SVHC: No SVHC
D2 = CMP-12187-000003-1: Rectifier Diode BAT48 SCHOTTKY 40V 350MA MINMELF; Manufacturer: STMicroelectronics; Max Surge Forward Current: 1.5A; Value: 20pF; Max Junction Temp: +125°C; Peak Reverse Current: 25uA; ComponentLink2Description: Datasheet; Manufacturer Part Number: TMMBAT48FILM; Height: 1.62mm; Forward Current: 350mA; Temperature: -65°C to +125°C; Max Repetitive Reverse Voltage: 40V; Category: Diode; Temperature Range Low: -65°C; Reverse Voltage: 40V; Device Class L3: Schottky Diodes; RoHS: TRUE; Digikey Description: DIODE SCHOTTKY 40V 350MA MINMELF; ComponentLink2URL: https://www.st.com/resource/en/datasheet/tmmbat48.pdf; Temperature Range High: +125°C; Octopart: https://octopart.com/tmmbat48film-stmicroelectronics-324396; Lead Free: Yes; Capacitance: 20pF; Device Class L1: Discrete Semiconductors; Device Class L2: Diodes; Automotive: No; Package: MINIMELF; Mouser Description: Schottky Diodes & Rectifiers 350mA 40 Volt
D3 D4 = CMP-2000-05518-3: Rectifier Diode 1N4148 GEN PURP 80V 125MA SOD523; Power Rating: 150mW; Peak Non-Repetitive Surge Current: 2A; Forward Voltage: 1.25V; Reverse Recovery Time: 4ns; Peak Reverse Current: 1uA; Max Repetitive Reverse Voltage (Vrrm): 100V; Capacitance: 2pF; Polarity: Standard; Element Configuration: Single; Forward Current: 250mA; Lead Free: Lead Free; Packaging: Tape and Reel; Length: 0.9mm; Min Operating Temperature: -65°C; Current Rating: 125mA; Max Reverse Voltage (DC): 80V; Width: 1.3mm; Package Quantity: 3000; Output Current: 125mA; Power Dissipation: 150mW; Max Operating Temperature: 150°C; Radiation Hardening: No; Average Rectified Current: 125mA; Height: 0.65mm; Voltage Rating (DC): 80V; Max Surge Current: 2A; Weight: 3.5E-05oz; Recovery Time: 4ns; Max Forward Surge Current (Ifsm): 2A; Contact Plating: Tin; Number of Pins: 2; Mount: Surface Mount; REACH SVHC: No SVHC
LS1 = CVS-1508: THT Speaker; Mfr_Name: Same Sky; RefDes: RefDes; Type: Type
P1 P2 = CMP-07234-000057-1: SMD TRIMMER 50K OHM 0.5W GW TOP ADJ; Power Rating: 500mW; Voltage Rating: 300V; Resistance Tolerance: 10%; Number of Turns: 1; Temperature Coefficient: 100ppm/°C; Height: 0.205inch; Radiation Hardening: No; RoHS Compliant: Yes; Length: 6.71mm; Depth: 8.53mm; Max Operating Temperature: 125°C; Military Standard: Not; Weight: 0.567g; Technology: CERMET; Voltage Rating (DC): 300V; Width: 0.264inch; Packaging: Tape and Reel; Lead Free: Lead Free; Tolerance: 10%; Reach SVHC Compliant: Yes; Taper: Linear; Min Operating Temperature: -55°C; Color: Natural; Package Quantity: 1; Resistor Type: Cermet; Contact Plating: Tin; Series: 3361; Mount: Surface Mount; Termination: Gull Wing; Max Power Dissipation: 500mW
Q2-Q11 = CMP-1048-01437-1: as Q1 on sheet KlokWave.Klok; Mounting Technology: Through Hole; ComponentLink1URL: http://www.onsemi.com/; ComponentLink1Description: Manufacturer URL; ComponentLink3URL: http://www.onsemi.cn/pub_link/Collateral/2N6426-D.PDF; DatasheetVersion: Rev. 7; PackageVersion: Rev. AM; Packing: Bulk Box; RoHS: FALSE; Polarity: NPN; PartNumber: BC547C; ComponentLink2URL: http://www.onsemi.com/pub_link/Collateral/BC546-D.PDF; ComponentLink3Description: Package Specification; PackageDescription: 3-Pin Transistor Outline, Body 4.825 x 3.685 mm, Pitch 1.27 mm; PackageReference: TO-92-3-29-11_AM_SL; ComponentLink2Description: Datasheet
R7-R45 = CMP-07231-006076-1: Thick Film Chip Resistors 0805 22.6Ω 0.125W 1% 100ppm/°C; Max Power Dissipation: 125mW; Voltage Rating: 150V; Package Quantity: 5000; Height: 0.024inch; Series: CR0805; Width: 0.049inch; Min Operating Temperature: -55°C; Max Operating Temperature: 155°C; Length: 2mm; Depth: 1.25mm; Military Standard: Not; Features: Moisture Resistant; Mount: Surface Mount; Tolerance: 1%; Termination: SMD/SMT; Contact Plating: Tin; Thickness: 508um; Resistor Type: Thick Film; Construction: Rectangular; Power Rating: 125mW; Case Code (Imperial): 0805; Case Code (Metric): 2012; Packaging: Tape and Reel; Temperature Coefficient: 100ppm/°C; Case/Package: 0805; Radiation Hardening: No; Number of Terminations: 2

## Sheet KlokWave.Display.SchDoc
size A4; SheetNumber: 3; SheetTotal: 3
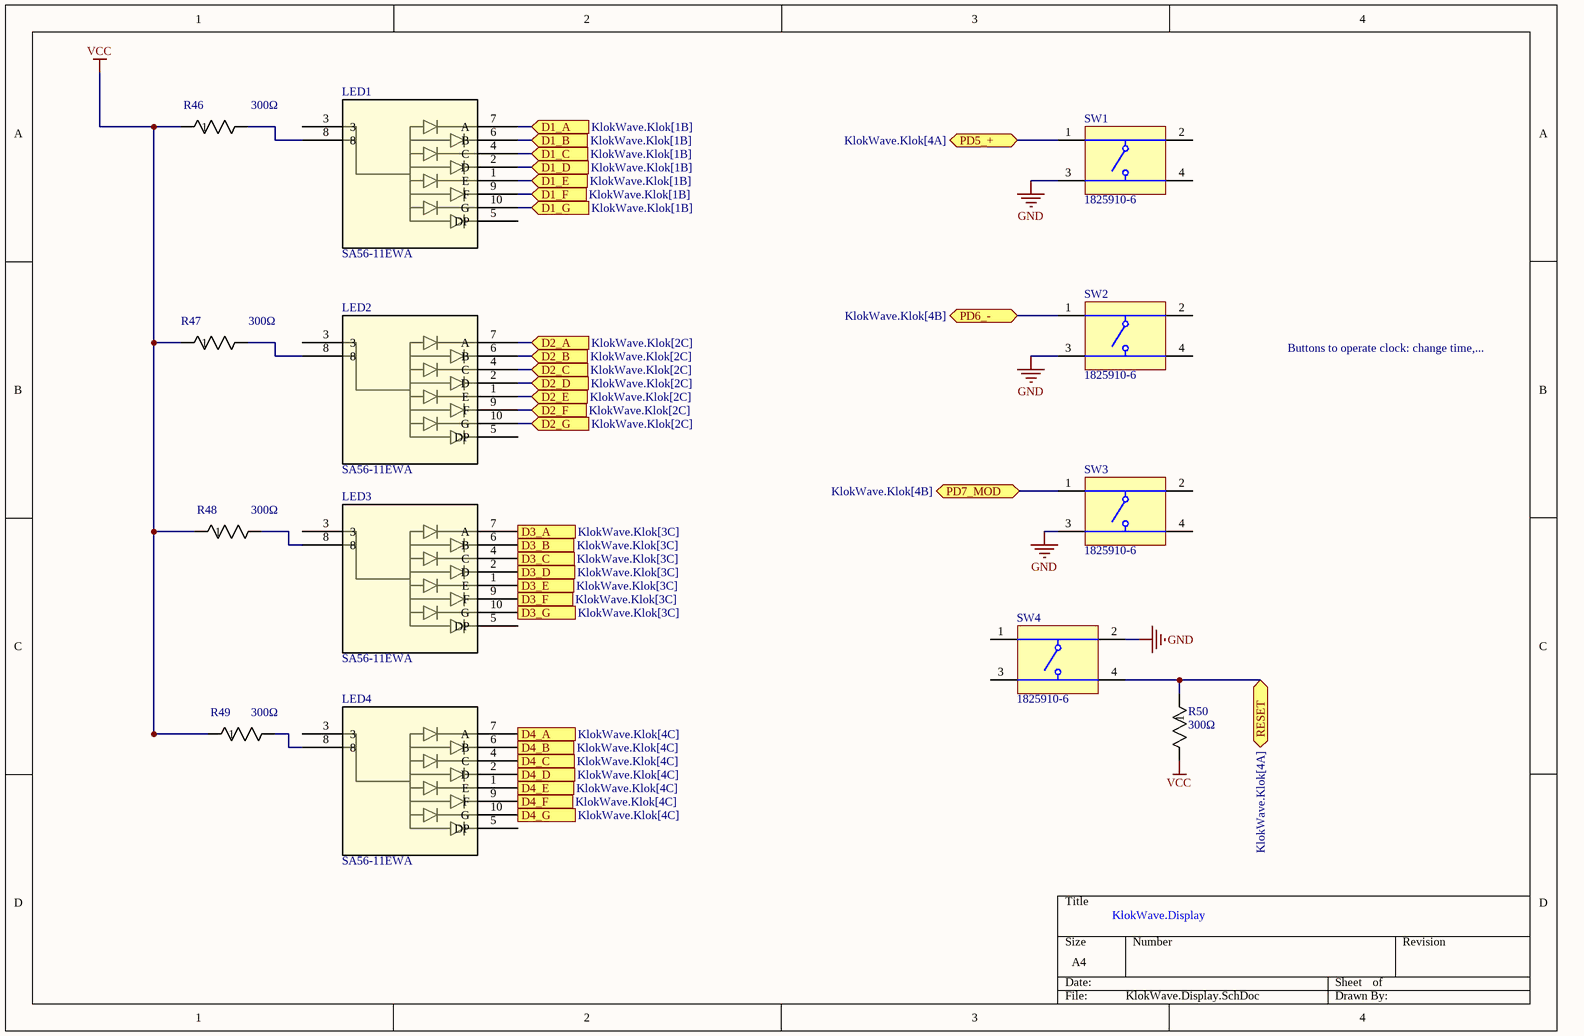
[diagram p2: KlokWave.Display.SchDoc]

### Parts
LED1  SA56-11EWA  [THT 7Seg: LED10_SA56-11EWA_KNB]
LED2  SA56-11EWA  [THT 7Seg: LED10_SA56-11EWA_KNB]
LED3  SA56-11EWA  [THT 7Seg: LED10_SA56-11EWA_KNB]
LED4  SA56-11EWA  [THT 7Seg: LED10_SA56-11EWA_KNB]
R46  Resistance: 300Ω  [THT Resistor: RES_AC03_VIS]  (hidden comment: AC03000003000JAC00)
R47  Resistance: 300Ω  [THT Resistor: RES_AC03_VIS]  (hidden comment: AC03000003000JAC00)
R48  Resistance: 300Ω  [THT Resistor: RES_AC03_VIS]  (hidden comment: AC03000003000JAC00)
R49  Resistance: 300Ω  [THT Resistor: RES_AC03_VIS]  (hidden comment: AC03000003000JAC00)
R50  Resistance: 300Ω  [THT Resistor: RES_AC03_VIS]  (hidden comment: AC03000003000JAC00)
SW1  1825910-6  [THT Button: TECO-1825910-6_V]
SW2  1825910-6  [THT Button: TECO-1825910-6_V]
SW3  1825910-6  [THT Button: TECO-1825910-6_V]
SW4  1825910-6  [THT Button: TECO-1825910-6_V]

### Ports
D1_A (in, see KlokWave.Klok[1B]), D1_B (in, see KlokWave.Klok[1B]), D1_C (in, see KlokWave.Klok[1B]), D1_D (in, see KlokWave.Klok[1B]), D1_E (in, see KlokWave.Klok[1B]), D1_F (in, see KlokWave.Klok[1B]), D1_G (in, see KlokWave.Klok[1B]), D2_A (in, see KlokWave.Klok[2C]), D2_B (in, see KlokWave.Klok[2C]), D2_C (in, see KlokWave.Klok[2C]), D2_D (in, see KlokWave.Klok[2C]), D2_E (in, see KlokWave.Klok[2C]), D2_F (in, see KlokWave.Klok[2C]), D2_G (in, see KlokWave.Klok[2C]), D3_A (in, see KlokWave.Klok[3C]), D3_B (in, see KlokWave.Klok[3C]), D3_C (in, see KlokWave.Klok[3C]), D3_D (in, see KlokWave.Klok[3C]), D3_E (in, see KlokWave.Klok[3C]), D3_F (in, see KlokWave.Klok[3C]), D3_G (in, see KlokWave.Klok[3C]), D4_A (in, see KlokWave.Klok[4C]), D4_B (in, see KlokWave.Klok[4C]), D4_C (in, see KlokWave.Klok[4C]), D4_D (in, see KlokWave.Klok[4C]), D4_E (in, see KlokWave.Klok[4C]), D4_F (in, see KlokWave.Klok[4C]), D4_G (in, see KlokWave.Klok[4C]), PD5_+ (bidir, see KlokWave.Klok[4A]), PD6_- (bidir, see KlokWave.Klok[4B]), PD7_MOD (bidir, see KlokWave.Klok[4B]), RESET (bidir, see KlokWave.Klok[4A])

### Nets
GND: SW1.3 SW2.3 SW3.3 SW4.2
VCC: R46.1 R47.1 R48.1 R49.1 R50.2
NetLED1_1: LED1.1(E) ; port D1_E
NetLED1_2: LED1.2(D) ; port D1_D
NetLED1_4: LED1.4(C) ; port D1_C
NetLED1_6: LED1.6(B) ; port D1_B
NetLED1_7: LED1.7(A) ; port D1_A
NetLED1_8: LED1.8 R46.2
NetLED1_9: LED1.9(F) ; port D1_F
NetLED1_10: LED1.10(G) ; port D1_G
NetLED2_1: LED2.1(E) ; port D2_E
NetLED2_2: LED2.2(D) ; port D2_D
NetLED2_4: LED2.4(C) ; port D2_C
NetLED2_6: LED2.6(B) ; port D2_B
NetLED2_7: LED2.7(A) ; port D2_A
NetLED2_8: LED2.8 R47.2
NetLED2_9: LED2.9(F) ; port D2_F
NetLED2_10: LED2.10(G) ; port D2_G
NetLED3_1: LED3.1(E) ; port D3_E
NetLED3_2: LED3.2(D) ; port D3_D
NetLED3_4: LED3.4(C) ; port D3_C
NetLED3_6: LED3.6(B) ; port D3_B
NetLED3_7: LED3.7(A) ; port D3_A
NetLED3_8: LED3.8 R48.2
NetLED3_9: LED3.9(F) ; port D3_F
NetLED3_10: LED3.10(G) ; port D3_G
NetLED4_1: LED4.1(E) ; port D4_E
NetLED4_2: LED4.2(D) ; port D4_D
NetLED4_4: LED4.4(C) ; port D4_C
NetLED4_6: LED4.6(B) ; port D4_B
NetLED4_7: LED4.7(A) ; port D4_A
NetLED4_8: LED4.8 R49.2
NetLED4_9: LED4.9(F) ; port D4_F
NetLED4_10: LED4.10(G) ; port D4_G
NetR50_1: R50.1 SW4.4 ; port RESET
NetSW1_1: SW1.1 ; port PD5_+
NetSW2_1: SW2.1 ; port PD6_-
NetSW3_1: SW3.1 ; port PD7_MOD

Not connected (* = marked no-connect by the designer): LED1 3 5(DP); LED2 3 5(DP); LED3 3 5(DP); LED4 3 5(DP); SW1 2 4; SW2 2 4; SW3 2 4; SW4 1 3

### Notes on the sheet
- Buttons to operate clock: change time,...
- KlokWave.Display

### Library data of the parts
LED1-LED4 = SA56-11EWA: THT CA 7SegDisplay; Mfr_Name: Kingbright; RefDes: RefDes; Type: Type
R46-R50 = CMP-00030-39746760-1: as R3 on sheet KlokWave.Klok; Max Operating Temperature: 275°C; Number of Pins: 2; Termination: Axial; Diameter: 4.8mm; Contact Plating: Tin; Packaging: Cut Tape (CT); Schedule B: 8533210080, 8533210080|8533210080|8533210080|8533210080|8533210080; Voltage Rating: 30V; Military Standard: Not; Composition: Wirewound; Power Rating: 3W; NexarPartId: 39746760; Case/Package: Axial; REACH SVHC: Unknown; Min Operating Temperature: -40°C; Thickness: 4.8006mm; Features: Flame Retardant Coating; Width: 4.8mm; Length: 13mm; RoHS: Compliant; Number of Terminations: 2
SW1-SW4 = CMP-1684-00021-1: THT Tact Switch, SPST-NO, 0.05 A, -35 to 85 degC, 4-Pin THD, RoHS, Bulk; Manufacturer: TE Connectivity; Maximum Contact Resistance: 100mOhm; Mechanical Life: 100000Cycles; Bushing Type: Unthreaded; Switch Configuration: OFF(ON); Maximum DC Voltage Rating: 24V; Contact Rating @ Voltage: 0.05A@24VDC; Actuator Color: Black; Body Orientation: Straight; Function: MomentaryContact; Illumination: N/R; Actuator Style: RoundButton; Actuator Material: PolybutyleneTerephthalate; Dielectric Strength: 500VAC; Pole Throw Configuration: SPST; Actuator Length: 1.4mm; Product Weight: N/A; Contact Material: CopperAlloy; Housing Material: N/A; Terminal Type: PCPins; Minimum Insulation Resistance: 100MOhm; Package Description: 4-Pin Through Hole Device, Body 5.99 x 5.99 mm, Pitch 6.5 mm; Part No: 1825910-6; Package Reference: THD; Base Material: N/A; Manufacturer URL: http://www.te.com; Contact Plating: Silver; RoHS: Yes; Datasheet Version: Rev. C9; Electrical Life: 100000Cycles; Maximum AC Voltage Rating: N/A; Thread Size: N/R; Operating Temperature: -35to85C; Mounting: ThroughHole; Dimension: 5.99x5mm; Datasheet URL: http://www.te.com/commerce/DocumentDelivery/DDEController?Action=showdoc&DocId=Customer+Drawing%7F1825910%7FC9%7Fpdf%7FEnglish%7FENG_CD_1825910_C9.pdf%7F1825910-6; Family: 1825910; Seal Location: N/A; Seal Description: N/A; Packaging: N/A

## Nets that join several sheets
GND: KlokWave.Klok (21 pins), KlokWave.Wave (23 pins), KlokWave.Display (SW1.3 SW2.3 SW3.3 SW4.2)
VCC: KlokWave.Klok (19 pins), KlokWave.Display (5 pins)
NetC19_2: KlokWave.Klok (Q1.3), KlokWave.Wave (10 pins)
NetLED1_1: KlokWave.Klok (U3.4), KlokWave.Display (LED1.1)
NetLED1_2: KlokWave.Klok (U3.3), KlokWave.Display (LED1.2)
NetLED1_4: KlokWave.Klok (U3.2), KlokWave.Display (LED1.4)
NetLED1_6: KlokWave.Klok (U3.1), KlokWave.Display (LED1.6)
NetLED1_7: KlokWave.Klok (U3.15), KlokWave.Display (LED1.7)
NetLED1_9: KlokWave.Klok (U3.5), KlokWave.Display (LED1.9)
NetLED1_10: KlokWave.Klok (U3.6), KlokWave.Display (LED1.10)
NetLED2_1: KlokWave.Klok (U5.4), KlokWave.Display (LED2.1)
NetLED2_2: KlokWave.Klok (U5.3), KlokWave.Display (LED2.2)
NetLED2_4: KlokWave.Klok (U5.2), KlokWave.Display (LED2.4)
NetLED2_6: KlokWave.Klok (U5.1), KlokWave.Display (LED2.6)
NetLED2_7: KlokWave.Klok (U5.15), KlokWave.Display (LED2.7)
NetLED2_9: KlokWave.Klok (U5.5), KlokWave.Display (LED2.9)
NetLED2_10: KlokWave.Klok (U5.6), KlokWave.Display (LED2.10)
NetLED3_1: KlokWave.Klok (U7.4), KlokWave.Display (LED3.1)
NetLED3_2: KlokWave.Klok (U7.3), KlokWave.Display (LED3.2)
NetLED3_4: KlokWave.Klok (U7.2), KlokWave.Display (LED3.4)
NetLED3_6: KlokWave.Klok (U7.1), KlokWave.Display (LED3.6)
NetLED3_7: KlokWave.Klok (U7.15), KlokWave.Display (LED3.7)
NetLED3_9: KlokWave.Klok (U7.5), KlokWave.Display (LED3.9)
NetLED3_10: KlokWave.Klok (U7.6), KlokWave.Display (LED3.10)
NetLED4_1: KlokWave.Klok (U6.4), KlokWave.Display (LED4.1)
NetLED4_2: KlokWave.Klok (U6.3), KlokWave.Display (LED4.2)
NetLED4_4: KlokWave.Klok (U6.2), KlokWave.Display (LED4.4)
NetLED4_6: KlokWave.Klok (U6.1), KlokWave.Display (LED4.6)
NetLED4_7: KlokWave.Klok (U6.15), KlokWave.Display (LED4.7)
NetLED4_9: KlokWave.Klok (U6.5), KlokWave.Display (LED4.9)
NetLED4_10: KlokWave.Klok (U6.6), KlokWave.Display (LED4.10)
NetR50_1: KlokWave.Klok (U1.1), KlokWave.Display (R50.1 SW4.4)
NetSW1_1: KlokWave.Klok (U1.11), KlokWave.Display (SW1.1)
NetSW2_1: KlokWave.Klok (U1.12), KlokWave.Display (SW2.1)
NetSW3_1: KlokWave.Klok (U1.13), KlokWave.Display (SW3.1)